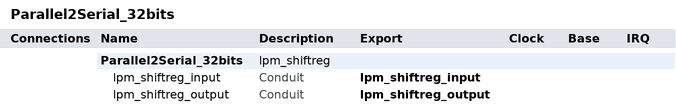
[diagram p0: system contents]
# Platform Designer (Qsys) system Parallel2Serial_32bits, Arria 10 10AS066H1F34E1SG
# Parameters at their usual value, and those the tool derives, are not listed.
package require qsys
create_system Parallel2Serial_32bits
set_project_property DEVICE_FAMILY {Arria 10}
set_project_property DEVICE 10AS066H1F34E1SG

add_instance Parallel2Serial_32bits lpm_shiftreg 18.0
set_instance_property Parallel2Serial_32bits AUTO_EXPORT true
set_instance_parameter_value Parallel2Serial_32bits GUI_ASET_VALUE 0
set_instance_parameter_value Parallel2Serial_32bits GUI_DIRECTION Left
set_instance_parameter_value Parallel2Serial_32bits GUI_SSET_VALUE 0
set_instance_parameter_value Parallel2Serial_32bits GUI_USE_ACLR_INPUT false
set_instance_parameter_value Parallel2Serial_32bits GUI_USE_ASET_INPUT false
set_instance_parameter_value Parallel2Serial_32bits GUI_USE_ASET_INPUT_1s false
set_instance_parameter_value Parallel2Serial_32bits GUI_USE_CLKEN_INPUT false
set_instance_parameter_value Parallel2Serial_32bits GUI_USE_DATA_OUTPUT false
set_instance_parameter_value Parallel2Serial_32bits GUI_USE_PARALLEL_INPUT true
set_instance_parameter_value Parallel2Serial_32bits GUI_USE_SCLR_INPUT false
set_instance_parameter_value Parallel2Serial_32bits GUI_USE_SERIAL_INPUT false
set_instance_parameter_value Parallel2Serial_32bits GUI_USE_SERIAL_OUTPUT true
set_instance_parameter_value Parallel2Serial_32bits GUI_USE_SSET_INPUT false
set_instance_parameter_value Parallel2Serial_32bits GUI_USE_SSET_INPUT_1s false
set_instance_parameter_value Parallel2Serial_32bits GUI_WIDTH 32

# exported interfaces
add_interface lpm_shiftreg_input conduit end
set_interface_property lpm_shiftreg_input EXPORT_OF Parallel2Serial_32bits.lpm_shiftreg_input
add_interface lpm_shiftreg_output conduit end
set_interface_property lpm_shiftreg_output EXPORT_OF Parallel2Serial_32bits.lpm_shiftreg_output

set_interconnect_requirement {$system} qsys_mm.clockCrossingAdapter HANDSHAKE
set_interconnect_requirement {$system} qsys_mm.enableEccProtection FALSE
set_interconnect_requirement {$system} qsys_mm.insertDefaultSlave FALSE
set_interconnect_requirement {$system} qsys_mm.maxAdditionalLatency 1

save_system Parallel2Serial_32bits.qsys
